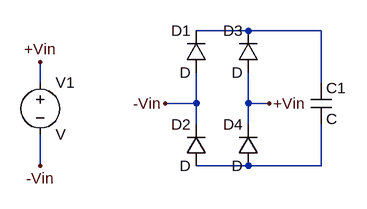
[diagram p0: schematic Draft1.asc]
Draft1.asc, the LTspice schematic file:
Version 4
SHEET 1 880 680
WIRE 96 0 16 0
WIRE 208 0 96 0
WIRE -224 80 -224 48
WIRE 208 80 208 0
WIRE 16 112 16 64
WIRE 16 112 -32 112
WIRE 96 112 96 64
WIRE 128 112 96 112
WIRE 16 144 16 112
WIRE 96 144 96 112
WIRE -224 208 -224 160
WIRE 96 208 16 208
WIRE 208 208 208 144
WIRE 208 208 96 208
FLAG -224 48 +Vin
FLAG 128 112 +Vin
FLAG -32 112 -Vin
FLAG -224 208 -Vin
SYMBOL voltage -224 64 R0
SYMATTR InstName V1
SYMBOL diode 32 64 R180
WINDOW 0 24 64 Left 2
WINDOW 3 24 0 Left 2
SYMATTR InstName D1
SYMBOL diode 112 64 R180
WINDOW 0 24 64 Left 2
WINDOW 3 24 0 Left 2
SYMATTR InstName D3
SYMBOL diode 112 208 R180
WINDOW 0 24 64 Left 2
WINDOW 3 24 0 Left 2
SYMATTR InstName D4
SYMBOL diode 32 208 R180
WINDOW 0 24 64 Left 2
WINDOW 3 24 0 Left 2
SYMATTR InstName D2
SYMBOL cap 192 80 R0
SYMATTR InstName C1

The netlist it stands for:
* Draft1.asc
V1 +Vin -Vin V
D1 -Vin N001 D
D3 +Vin N001 D
D4 N002 +Vin D
D2 N002 -Vin D
C1 N001 N002 C
.model D D
.lib standard.dio
.backanno
.end